# Altium schematic sheet VGA breakout.SchDoc
size A4
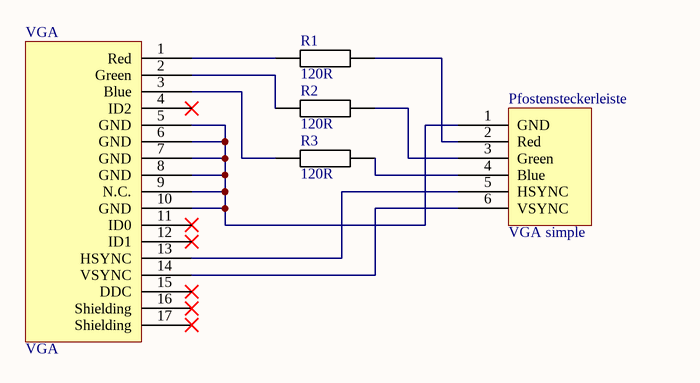
[diagram p0: VGA breakout.SchDoc]

## Parts
Pfostensteckerleiste  VGA simple  [Header 1x6]
R1  120R  [R 0805 / 2012]
R2  120R  [R 0805 / 2012]
R3  120R  [R 0805 / 2012]
VGA  VGA

## Nets
NetPfostensteckerleiste_1: Pfostensteckerleiste.1(GND) VGA.5(GND) VGA.6(GND) VGA.7(GND) VGA.8(GND) VGA.9(N.C.) VGA.10(GND)
NetPfostensteckerleiste_2: Pfostensteckerleiste.2(Red) R1.2
NetPfostensteckerleiste_3: Pfostensteckerleiste.3(Green) R2.2
NetPfostensteckerleiste_4: Pfostensteckerleiste.4(Blue) R3.2
NetPfostensteckerleiste_5: Pfostensteckerleiste.5(HSYNC) VGA.13(HSYNC)
NetPfostensteckerleiste_6: Pfostensteckerleiste.6(VSYNC) VGA.14(VSYNC)
NetR1_1: R1.1 VGA.1(Red)
NetR2_1: R2.1 VGA.2(Green)
NetR3_1: R3.1 VGA.3(Blue)

Not connected (* = marked no-connect by the designer): VGA 4(ID2)* 11(ID0)* 12(ID1)* 15(DDC)* 16(Shielding)* 17(Shielding)*

## Library data of the parts
R1-R3 = Resistor